# EAGLE design OSO-MISC-22-005 UART Breakout (EAGLE 9.6.2)
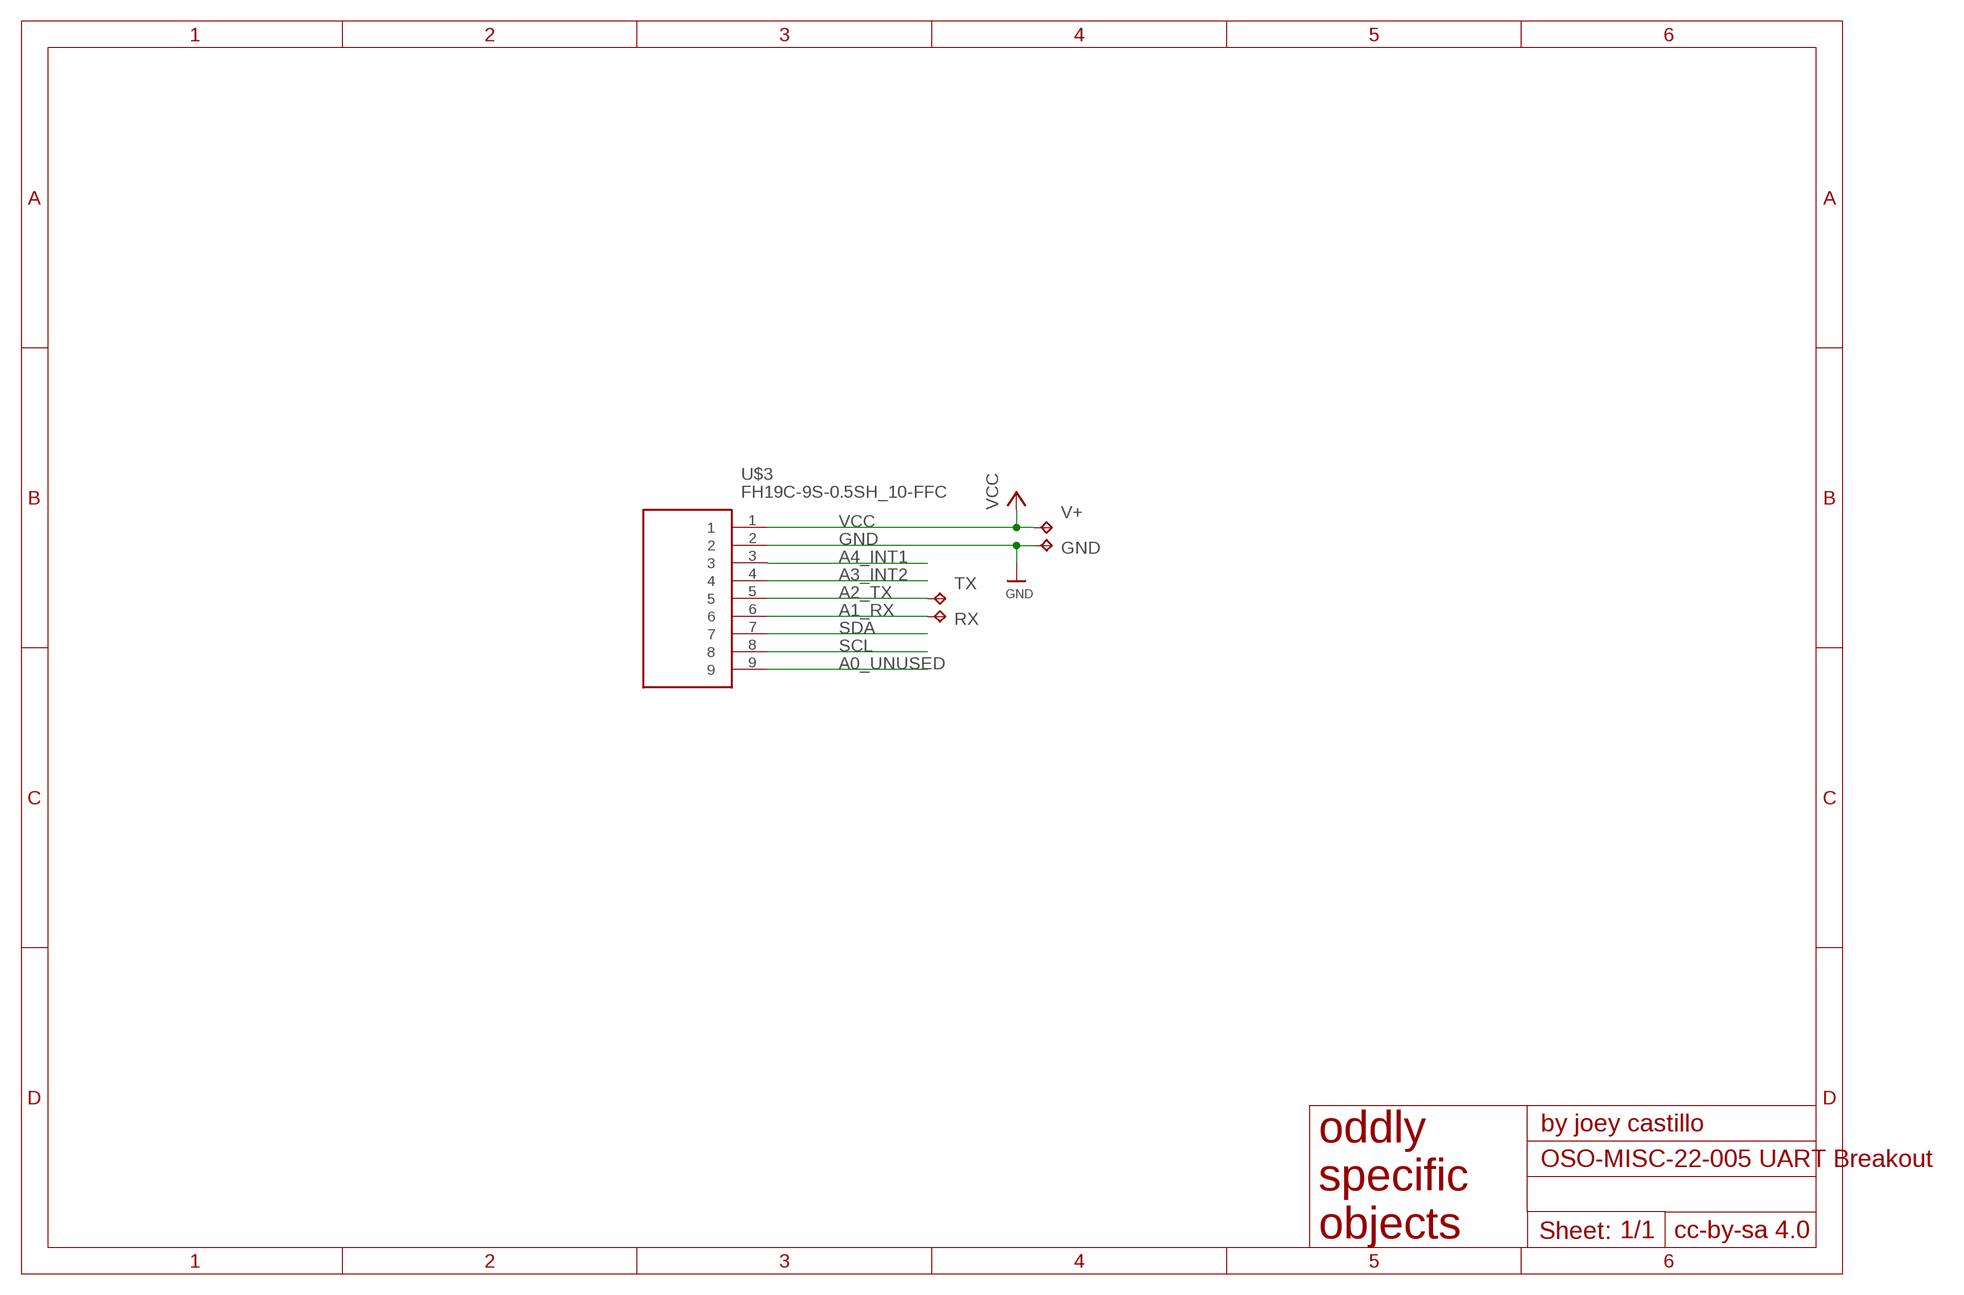
[diagram p0: schematic, sheet 1]

## Parts
GND  TPTP20R  [TP20R]
RX  TPTP20R  [TP20R]
TX  TPTP20R  [TP20R]
U$3  FH19C-9S-0.5SH_10-FFC  [FH19C9S05SH10-FFC]
V+  TPTP20R  [TP20R]

## Nets
A0_UNUSED: U$3.9
A1_RX: RX.TP U$3.6
A2_TX: TX.TP U$3.5
A3_INT2: U$3.4
A4_INT1: U$3.3
GND [gnd]: GND.TP U$3.2
SCL: U$3.8
SDA: U$3.7
VCC: U$3.1 V+.TP

## Library data of the parts
GND RX TX V+ = testpad:TP: Test pad
U$3 = FH19C-9S-0.5SH:FH19C-9S-0.5SH_10-FFC

## Net classes
0 default: width 0.152 mm
1 power: width 0.152 mm
2 gnd: width 0.152 mm

## Board
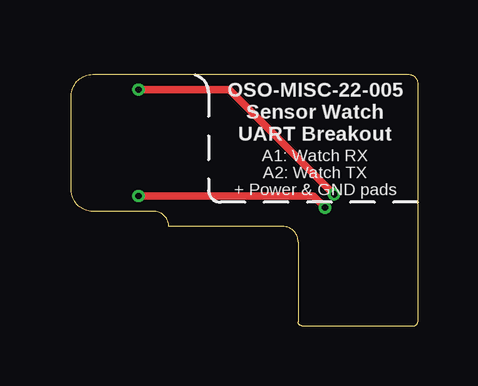
[diagram p1: board, top side]
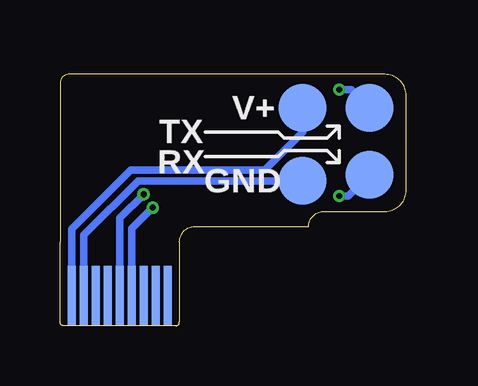
[diagram p2: board, bottom side, seen from below]

Size 14.43 x 10.48 mm. Coordinates in mm from the lower left corner, seen from the top.
Outline: 9.45,3.5 arc90 8.81,4.13 4.06,4.13 arc90 3.43,4.77 0.89,4.77 arc-90 0,5.66 0,9.6 arc-90 0.89,10.48 14.05,10.48 arc-90 14.43,10.1 14.43,3.5
Copper layers (1*16): Top 0.035559375mm / dielectric 1.6mm / Bottom 0.035559375mm
Design rules "oshpark-2layer *": minimum track width 6mil, minimum drill 10mil, track to track 6mil, track to pad 6mil, pad to pad 6mil, via to via 6mil, smd to smd 6mil, copper to edge 15mil, drill to drill 6mil, minimum pad ring 5mil, minimum via ring 5mil, stop-mask expansion 2.5mil, vias tented up to drill 10mil, thermal gap 10mil

### Footprints (pad centres in the part's own frame; a part is rotated, then mirrored left to right if it is on the bottom)
TP20R = smd 2 x 2: TP 0,0
FH19C9S05SH10-FFC = smd 0.347 x 2.5 bottom: 1 2,-2.25; 2 1.5,-2.25; 3 1,-2.25; 4 0.5,-2.25; 5 0,-2.25; 6 -0.5,-2.25; 7 -1,-2.25; 8 -1.5,-2.25; 9 -2,-2.25

### Placement (x,y rotation side)
GND  4.32,6.04 0 bottom
RX  1.52,6.29 0 bottom
TX  1.52,9.09 0 bottom
U$3  11.94,3.5 0 top
V+  4.32,9.09 0 bottom

### Tracks (layer width: path | path; a pad name or v marks a point on that pad's centre or on a via)
A1_RX  (via drill 0.25)
  Top 0.305: v10.57,4.92 10.09,5.4 v2.79,5.4
  Bottom 0.305: U$3.6 11.44,4.05 v10.57,4.92 | v2.79,5.4 2.41,5.4 RX.TP
A2_TX  (via drill 0.25)
  Top 0.305: v10.95,5.48 6.58,9.85 v2.79,9.85
  Bottom 0.305: U$3.5 11.94,4.49 v10.95,5.48 | v2.79,9.85 2.29,9.85 TX.TP
GND
  Bottom 0.305: U$3.2 13.44,3.78 11.18,6.04 GND.TP
VCC
  Bottom 0.305: U$3.1 13.94,4.04 11.48,6.5 5.89,6.5 4.32,8.07 V+.TP

### Text on the board
tPlace: OSO-MISC-22-005 / Sensor Watch / UART Breakout | A1: Watch RX / A2: Watch TX / + Power & GND pads